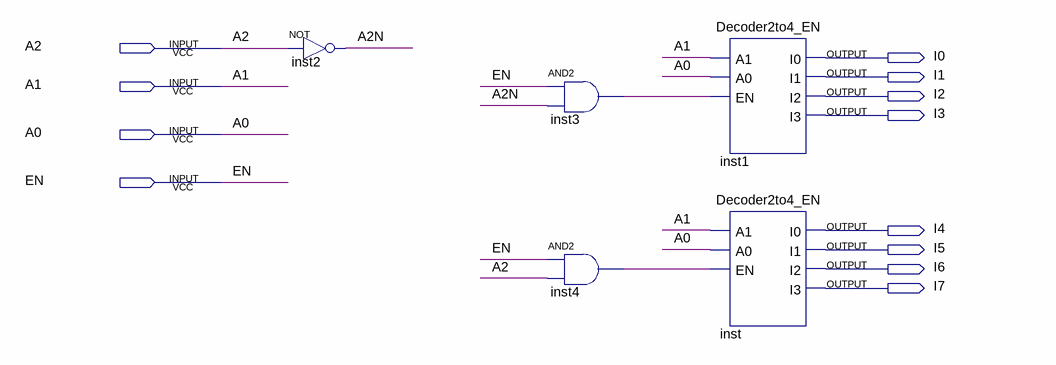
[diagram p0: schematic sheet]
// Quartus schematic Decoder3to8_EN.bdf as structural Verilog: 5 symbols, 12 pins
module Decoder3to8_EN (
  input  A2,
  input  A1,
  input  A0,
  input  EN,
  output I0,
  output I1,
  output I2,
  output I3,
  output I4,
  output I5,
  output I6,
  output I7
);

  wire A2N, inst3_out, inst4_out;

  not inst2 (A2N, A2);
  and inst3 (inst3_out, EN, A2N);
  and inst4 (inst4_out, EN, A2);
  Decoder2to4_EN inst1 (.A1(A1), .A0(A0), .EN(inst3_out), .I0(I0), .I1(I1), .I2(I2), .I3(I3));
  Decoder2to4_EN inst (.A1(A1), .A0(A0), .EN(inst4_out), .I0(I4), .I1(I5), .I2(I6), .I3(I7));
endmodule
